# Altium schematic sheet VoltageDivider.SchDoc
size A
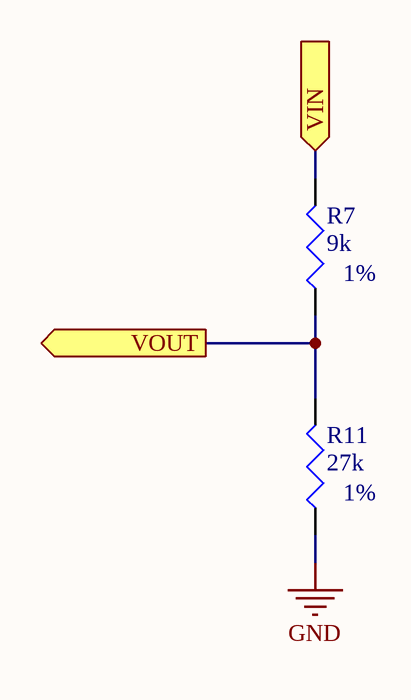
[diagram p0: VoltageDivider.SchDoc]

## Parts
R7  1%  value 9k  [J1-0603]
R11  1%  value 27k  [J1-0603]

## Ports
VIN (in), VOUT (out)

## Nets
GND: R11.1
VIN: R7.2 ; port VIN
VOUT: R7.1 R11.2 ; port VOUT

## Library data of the parts
R7 R11 = Res3: Resistor; Published: 8-Jun-2000; LatestRevisionDate: 29-May-2009; LatestRevisionNote: IPC-7351 Footprint Added.; PackageReference: J1-0603; Publisher: Altium Limited; PackageDescription: Chip Resistor; Supplier 1: Digi-Key
  R7: Supplier Part Number 1: 311-9.10KHRCT-ND
  R11: Supplier Part Number 1: MCT0603-27.0K-CFCT-ND